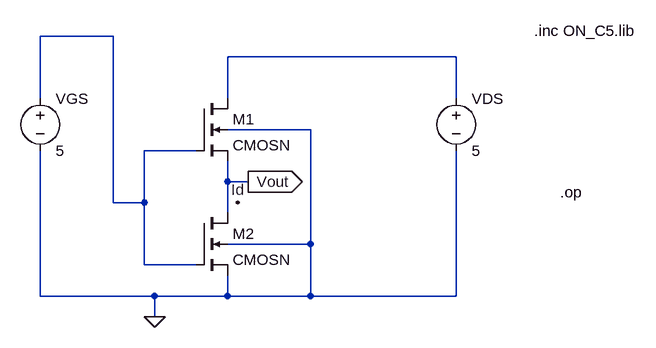
[diagram p0: schematic prob_2.asc]
prob_2.asc, the LTspice schematic file:
Version 4
SHEET 1 900 680
WIRE 64 16 -48 16
WIRE 592 48 240 48
WIRE -48 112 -48 16
WIRE 240 112 240 48
WIRE 592 112 592 48
WIRE 368 160 240 160
WIRE 192 192 112 192
WIRE 240 240 240 208
WIRE 272 240 240 240
WIRE 64 272 64 16
WIRE 112 272 112 192
WIRE 112 272 64 272
WIRE 240 288 240 240
WIRE 368 336 368 160
WIRE 368 336 240 336
WIRE 112 368 112 272
WIRE 192 368 112 368
WIRE -48 416 -48 192
WIRE 128 416 -48 416
WIRE 240 416 240 384
WIRE 240 416 128 416
WIRE 368 416 368 336
WIRE 368 416 240 416
WIRE 592 416 592 192
WIRE 592 416 368 416
WIRE 128 448 128 416
FLAG 128 448 0
FLAG 272 240 Vout
IOPIN 272 240 Out
FLAG 256 272 Id
SYMBOL voltage -48 96 R0
WINDOW 123 0 0 Left 2
WINDOW 39 0 0 Left 2
SYMATTR InstName VGS
SYMATTR Value 5
SYMBOL voltage 592 96 R0
WINDOW 123 0 0 Left 2
WINDOW 39 0 0 Left 2
SYMATTR InstName VDS
SYMATTR Value 5
SYMBOL nmos4 192 112 R0
SYMATTR InstName M1
SYMATTR Value2 l=0.6u w=3u
SYMATTR Value CMOSN
SYMBOL nmos4 192 288 R0
SYMATTR InstName M2
SYMATTR Value2 l=0.6u w=3u
SYMATTR Value CMOSN
TEXT 752 256 Left 2 !.op
TEXT 712 8 Left 2 !.inc ON_C5.lib

The netlist it stands for:
* prob_2.asc
VGS N001 0 5
VDS N002 0 5
M1 N002 N001 Vout 0 CMOSN l=0.6u w=3u
M2 Vout N001 0 0 CMOSN l=0.6u w=3u
.model NMOS NMOS
.model PMOS PMOS
.lib standard.mos
.op
.inc ON_C5.lib
.backanno
.end